# EAGLE design Arduino-DUE-SHEILD-4X4-Blank-Pin-Schematic (EAGLE 8.2.1)
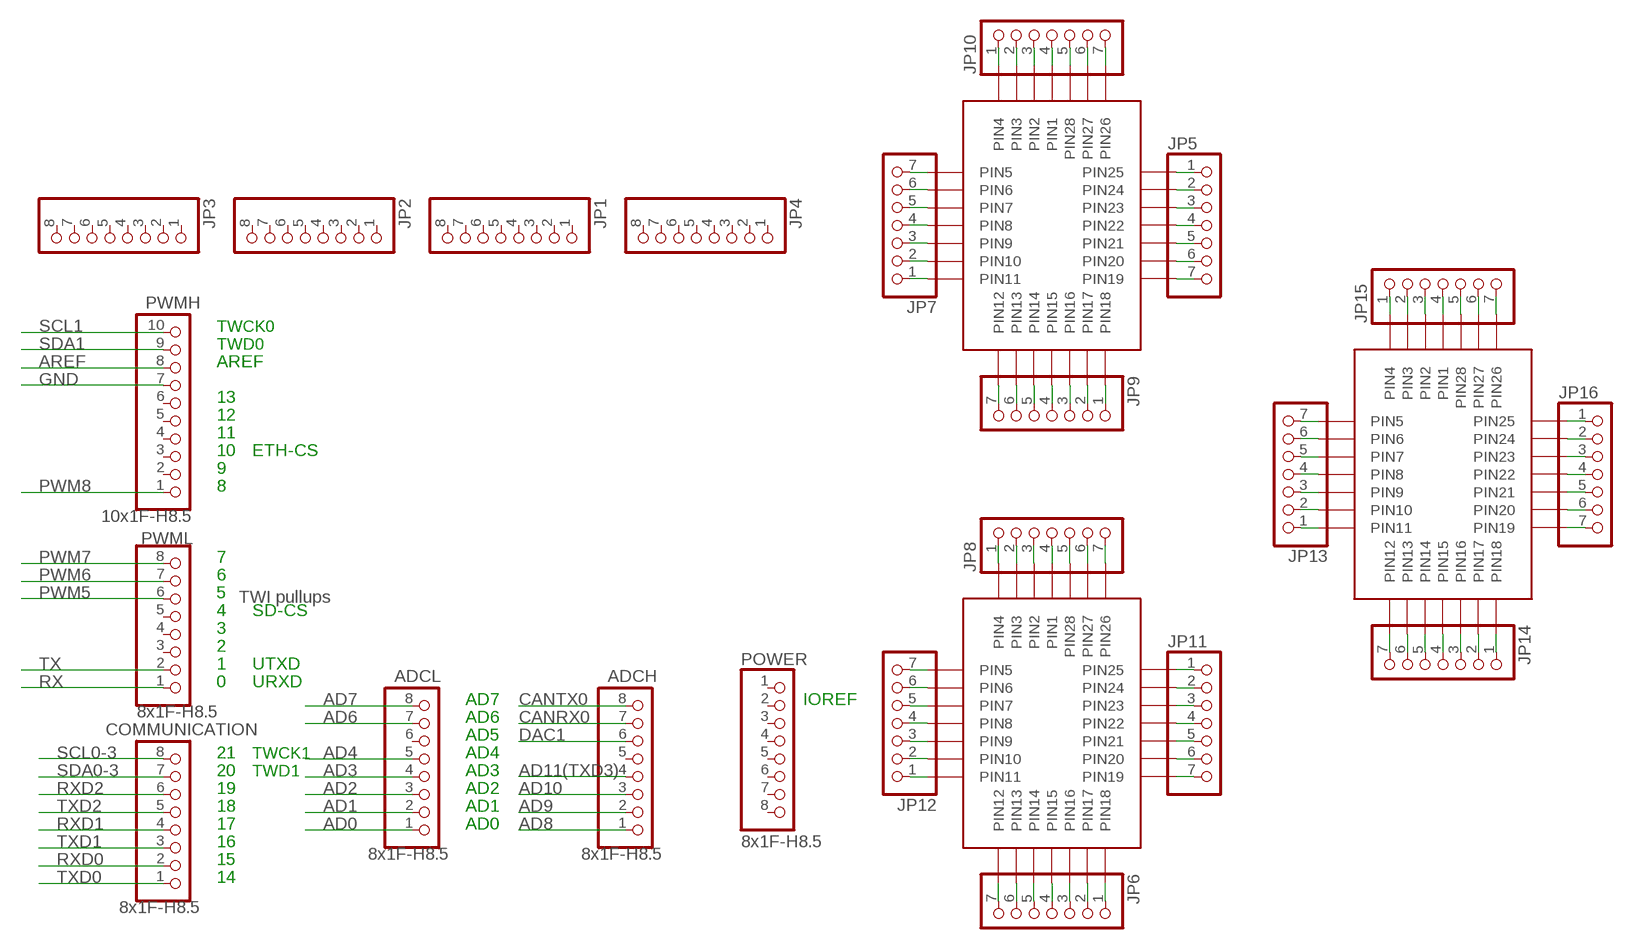
[diagram p0: schematic, sheet 1]

## Parts
ADCH  8x1F-H8.5  PINHD-1X8  [1X08]
ADCL  8x1F-H8.5  PINHD-1X8  [1X08]
COMMUNICATION  8x1F-H8.5  PINHD-1X8  [1X08]
JP1  PINHD-1X8  [1X08]
JP2  PINHD-1X8  [1X08]
JP3  PINHD-1X8  [1X08]
JP4  PINHD-1X8  [1X08]
JP5  PINHD-1X7  [1X07]
JP6  PINHD-1X7  [1X07]
JP7  PINHD-1X7  [1X07]
JP8  PINHD-1X7  [1X07]
JP9  PINHD-1X7  [1X07]
JP10  PINHD-1X7  [1X07]
JP11  PINHD-1X7  [1X07]
JP12  PINHD-1X7  [1X07]
JP13  PINHD-1X7  [1X07]
JP14  PINHD-1X7  [1X07]
JP15  PINHD-1X7  [1X07]
JP16  PINHD-1X7  [1X07]
POWER  8x1F-H8.5  PINHD-1X8  [1X08]
PWMH  10x1F-H8.5  PINHD-1X10  [1X10]
PWML  8x1F-H8.5  PINHD-1X8  [1X08]
U$1  S28  [S28]
U$2  S28  [S28]
U$3  S28  [S28]

## Nets
AD0: ADCL.1
AD1: ADCL.2
AD2: ADCL.3
AD3: ADCL.4
AD4: ADCL.5
AD6: ADCL.7
AD7: ADCL.8
AD8: ADCH.1
AD9: ADCH.2
AD10: ADCH.3
AD11(TXD3): ADCH.4
AREF: PWMH.8
CANRX0: ADCH.7
CANTX0: ADCH.8
DAC1: ADCH.6
GND: PWMH.7
N$3: JP7.7 U$1.5(PIN5)
N$11: JP7.6 U$1.6(PIN6)
N$12: JP7.5 U$1.7(PIN7)
N$13: JP7.4 U$1.8(PIN8)
N$14: JP7.3 U$1.9(PIN9)
N$15: JP7.2 U$1.10(PIN10)
N$16: JP7.1 U$1.11(PIN11)
N$17: JP9.7 U$1.12(PIN12)
N$18: JP9.6 U$1.13(PIN13)
N$19: JP9.5 U$1.14(PIN14)
N$20: JP9.4 U$1.15(PIN15)
N$21: JP9.3 U$1.16(PIN16)
N$22: JP9.2 U$1.17(PIN17)
N$23: JP9.1 U$1.18(PIN18)
N$24: JP5.7 U$1.19(PIN19)
N$25: JP5.6 U$1.20(PIN20)
N$26: JP5.5 U$1.21(PIN21)
N$27: JP5.4 U$1.22(PIN22)
N$28: JP5.3 U$1.23(PIN23)
N$29: JP5.2 U$1.24(PIN24)
N$30: JP5.1 U$1.25(PIN25)
N$31: JP10.1 U$1.4(PIN4)
N$32: JP10.2 U$1.3(PIN3)
N$33: JP10.3 U$1.2(PIN2)
N$34: JP10.4 U$1.1(PIN1)
N$35: JP10.5 U$1.28(PIN28)
N$36: JP10.6 U$1.27(PIN27)
N$37: JP10.7 U$1.26(PIN26)
N$38: JP8.1 U$2.4(PIN4)
N$39: JP8.2 U$2.3(PIN3)
N$40: JP8.3 U$2.2(PIN2)
N$41: JP8.4 U$2.1(PIN1)
N$42: JP8.5 U$2.28(PIN28)
N$43: JP8.6 U$2.27(PIN27)
N$44: JP8.7 U$2.26(PIN26)
N$45: JP13.7 U$3.5(PIN5)
N$46: JP13.6 U$3.6(PIN6)
N$47: JP13.5 U$3.7(PIN7)
N$48: JP13.4 U$3.8(PIN8)
N$49: JP13.3 U$3.9(PIN9)
N$50: JP13.2 U$3.10(PIN10)
N$51: JP13.1 U$3.11(PIN11)
N$52: JP6.7 U$2.12(PIN12)
N$53: JP6.6 U$2.13(PIN13)
N$54: JP6.5 U$2.14(PIN14)
N$55: JP6.4 U$2.15(PIN15)
N$56: JP6.3 U$2.16(PIN16)
N$57: JP6.2 U$2.17(PIN17)
N$58: JP6.1 U$2.18(PIN18)
N$59: JP11.7 U$2.19(PIN19)
N$60: JP11.6 U$2.20(PIN20)
N$61: JP11.5 U$2.21(PIN21)
N$62: JP11.4 U$2.22(PIN22)
N$63: JP11.3 U$2.23(PIN23)
N$64: JP11.2 U$2.24(PIN24)
N$65: JP11.1 U$2.25(PIN25)
N$66: JP12.7 U$2.5(PIN5)
N$67: JP12.6 U$2.6(PIN6)
N$68: JP12.5 U$2.7(PIN7)
N$69: JP12.4 U$2.8(PIN8)
N$70: JP12.3 U$2.9(PIN9)
N$71: JP12.2 U$2.10(PIN10)
N$72: JP12.1 U$2.11(PIN11)
N$73: JP15.1 U$3.4(PIN4)
N$74: JP15.2 U$3.3(PIN3)
N$75: JP15.3 U$3.2(PIN2)
N$76: JP15.4 U$3.1(PIN1)
N$77: JP15.5 U$3.28(PIN28)
N$78: JP15.6 U$3.27(PIN27)
N$79: JP15.7 U$3.26(PIN26)
N$80: JP16.1 U$3.25(PIN25)
N$81: JP16.2 U$3.24(PIN24)
N$82: JP16.3 U$3.23(PIN23)
N$83: JP16.4 U$3.22(PIN22)
N$84: JP16.5 U$3.21(PIN21)
N$85: JP16.6 U$3.20(PIN20)
N$86: JP16.7 U$3.19(PIN19)
N$87: JP14.1 U$3.18(PIN18)
N$88: JP14.2 U$3.17(PIN17)
N$89: JP14.3 U$3.16(PIN16)
N$90: JP14.4 U$3.15(PIN15)
N$91: JP14.5 U$3.14(PIN14)
N$92: JP14.6 U$3.13(PIN13)
N$93: JP14.7 U$3.12(PIN12)
PWM5: PWML.6
PWM6: PWML.7
PWM7: PWML.8
PWM8: PWMH.1
RX: PWML.1
RXD0: COMMUNICATION.2
RXD1: COMMUNICATION.4
RXD2: COMMUNICATION.6
SCL0-3: COMMUNICATION.8
SCL1: PWMH.10
SDA0-3: COMMUNICATION.7
SDA1: PWMH.9
TX: PWML.2
TXD0: COMMUNICATION.1
TXD1: COMMUNICATION.3
TXD2: COMMUNICATION.5
Unconnected: ADCH.5 ADCL.6 JP1.1 JP1.2 JP1.3 JP1.4 JP1.5 JP1.6 JP1.7 JP1.8 JP2.1 JP2.2 JP2.3 JP2.4 JP2.5 JP2.6 JP2.7 JP2.8 JP3.1 JP3.2 JP3.3 JP3.4 JP3.5 JP3.6 JP3.7 JP3.8 JP4.1 JP4.2 JP4.3 JP4.4 JP4.5 JP4.6 JP4.7 JP4.8 POWER.1 POWER.2 POWER.3 POWER.4 POWER.5 POWER.6 POWER.7 POWER.8 PWMH.2 PWMH.3 PWMH.4 PWMH.5 PWMH.6 PWML.3 PWML.4 PWML.5

## Notes on the sheet
- TWCK0
- TWD0
- AREF
- 13
- 12
- 11
- 10 | ETH-CS
- 9
- 8
- 7
- 6
- 5 | TWI pullups
- 4 | SD-CS
- 3
- 2
- 1 | UTXD
- 0 | URXD
- AD7 | IOREF
- AD6
- AD5
- 21 | TWCK1 | AD4
- 20 | TWD1 | AD3
- 19 | AD2
- 18 | AD1
- 17 | AD0
- 16
- 15
- 14

## Library data of the parts
ADCH ADCL COMMUNICATION POWER PWML = SmartPrj:PINHD-1X8: PIN HEADER
JP1-JP4 = pinhead:PINHD-1X8: PIN HEADER
JP5-JP16 = pinhead:PINHD-1X7: PIN HEADER
PWMH = SmartPrj:PINHD-1X10: PIN HEADER
U$1-U$3 = plcc-socket:S28

## Net classes
0 default: width 0.203 mm, drill 0.406 mm, clearance 0.203 mm
1 USB: width 0.203 mm, drill 0.406 mm, clearance 0.203 mm
2 gnd: width 0.203 mm, drill 0.406 mm, clearance 0.203 mm
3 usbvcc: width 0.203 mm, drill 0.406 mm, clearance 0.203 mm
4 USBpair: width 0.254 mm, drill 0.406 mm, clearance 0.61 mm

## Board
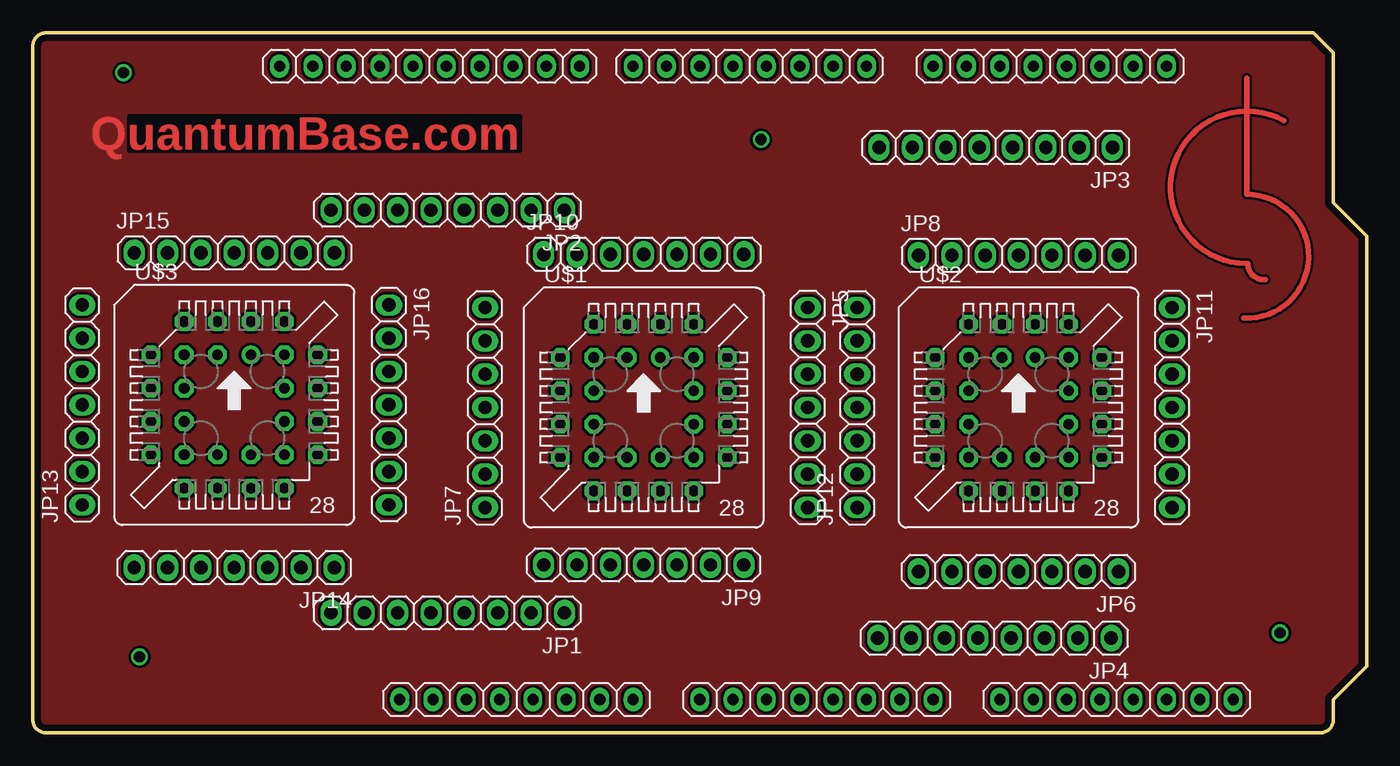
[diagram p1: board, top side]
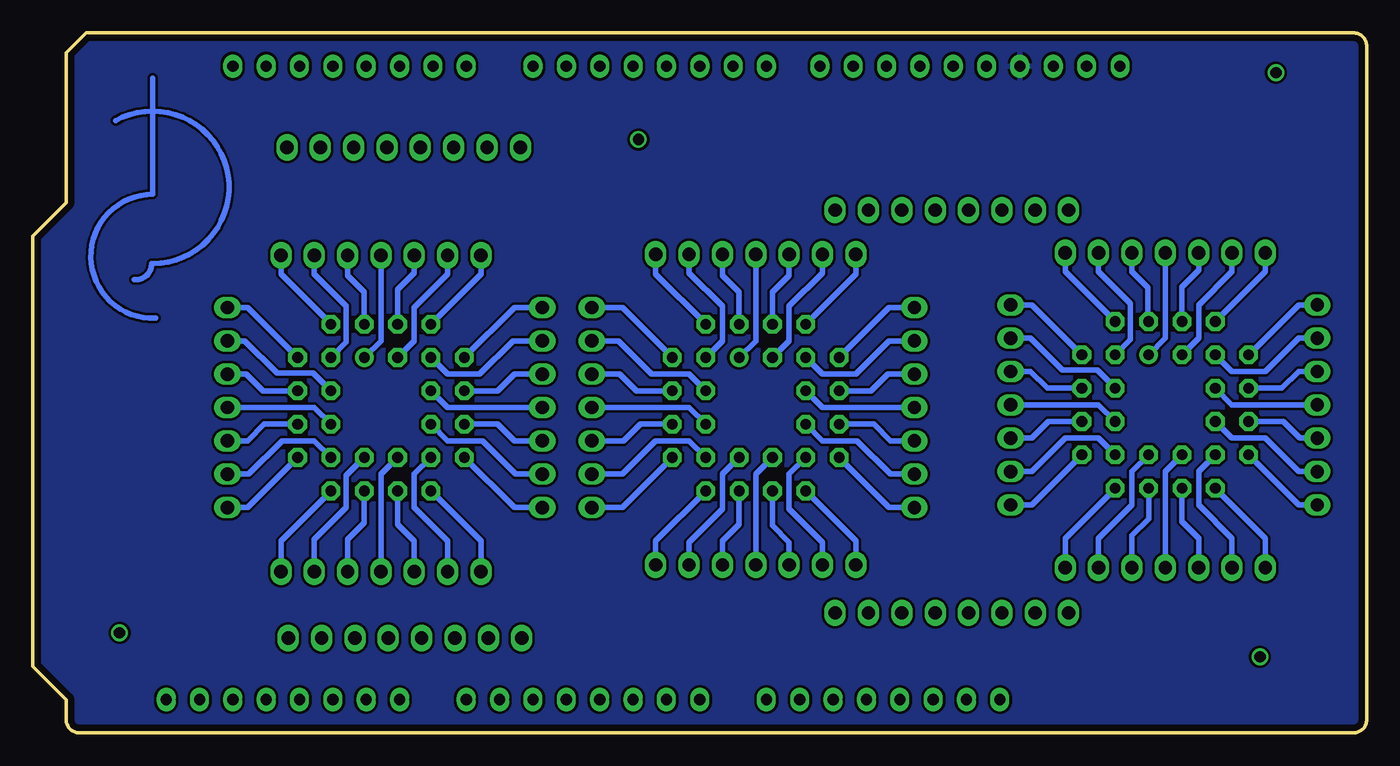
[diagram p2: board, bottom side, seen from below]

Size 101.6 x 53.34 mm. Coordinates in mm from the lower left corner, seen from the top.
Outline: 97.54,53.34 99.06,51.82 99.06,40.39 101.6,37.85 101.6,5.08 99.06,2.54 99.06,1 arc-90 98.06,0 1,0 arc-90 0,1 0,52.34 arc-90 1,53.34 97.54,53.34
Copper layers (1*16): Top 0.035mm / dielectric 1.6mm / Bottom 0.035mm
Design rules "default *": minimum track width 8mil, minimum drill 16mil, track to track 0.205mm, track to pad 0.25mm, pad to pad 0.25mm, via to via 0.205mm, smd to smd 0.205mm, copper to edge 20mil, drill to drill 12mil, minimum pad ring 12mil, minimum via ring 8mil, stop-mask expansion 2mil, vias tented up to drill 25mil, thermal gap 8mil

### Footprints (pad centres in the part's own frame; a part is rotated, then mirrored left to right if it is on the bottom)
1X08 = drill 0.85 pad 1.422 long: 1 -8.89,0; 2 -6.35,0; 3 -3.81,0; 4 -1.27,0; 5 1.27,0; 6 3.81,0; 7 6.35,0; 8 8.89,0
1X08' = drill 1.016 long: 1 -8.89,0; 2 -6.35,0; 3 -3.81,0; 4 -1.27,0; 5 1.27,0; 6 3.81,0; 7 6.35,0; 8 8.89,0
1X07 = drill 1.016 long: 1 -7.62,0; 2 -5.08,0; 3 -2.54,0; 4 0,0; 5 2.54,0; 6 5.08,0; 7 7.62,0
1X10 = drill 0.85 pad 1.422 long: 1 -11.43,0; 2 -8.89,0; 3 -6.35,0; 4 -3.81,0; 5 -1.27,0; 6 1.27,0; 7 3.81,0; 8 6.35,0; 9 8.89,0; 10 11.43,0
S28 = drill 0.813: 1 1.27,3.81 | drill 0.813 octagon: 2 -1.27,6.35; 3 -1.27,3.81; 4 -3.81,6.35; 5 -6.35,3.81; 6 -3.81,3.81; 7 -6.35,1.27; 8 -3.81,1.27; 9 -6.35,-1.27; 10 -3.81,-1.27; 11 -6.35,-3.81; 12 -3.81,-6.35; 13 -3.81,-3.81; 14 -1.27,-6.35; 15 -1.27,-3.81; 16 1.27,-6.35; 17 1.27,-3.81; 18 3.81,-6.35; 19 6.35,-3.81; 20 3.81,-3.81; 21 6.35,-1.27; 22 3.81,-1.27; 23 6.35,1.27; 24 3.81,1.27; 25 6.35,3.81; 26 3.81,6.35; 27 3.81,3.81; 28 1.27,6.35

### Placement (x,y rotation side)
ADCH  82.55,2.54 0 top
ADCL  59.69,2.54 0 top
COMMUNICATION  77.47,50.8 0 top
JP1  [1X08']  31.6,9.14 180 top
JP2  [1X08']  31.6,39.83 180 top
JP3  [1X08']  73.36,44.6 180 top
JP4  [1X08']  73.25,7.21 180 top
JP5  59.03,24.79 270 top
JP6  75.08,12.29 180 top
JP7  34.44,24.79 90 top
JP8  75.08,36.37 0 top
JP9  46.53,12.8 180 top
JP10  46.53,36.47 0 top
JP11  86.77,24.79 270 top
JP12  62.79,24.79 90 top
JP13  3.76,24.99 90 top
JP14  15.34,12.6 180 top
JP15  15.34,36.58 0 top
JP16  27.13,24.99 270 top
POWER  36.83,2.54 0 top
PWMH  30.23,50.8 180 top
PWML  54.61,50.8 180 top
U$1  46.53,24.79 0 top
U$2  75.08,24.79 0 top
U$3  15.34,24.99 0 top

### Tracks (layer width: path | path; a pad name or v marks a point on that pad's centre or on a via)
GND
  pour Top: -1.42,54.46 103.73,54.46 103.73,-2.95 -1.42,-2.95
  pour Bottom: -2.13,54.36 104.04,54.36 104.04,-2.54 -2.13,-2.54
N$1
  Top 0.406: 92.46,49.89 92.46,41.05 arc-182 92.25,31.6
N$2
  Bottom 0.406: 92.46,35.76 arc-209 95.3,46.63
N$3
  Bottom 0.406: U$1.5 36.37,32.41 JP7.7
N$4
  Bottom 0.406: 93.88,34.54 arc-97 92.56,35.76
N$8
  Bottom 0.406: 92.46,49.89 92.46,41.05 arc-182 92.25,31.6
N$9
  Top 0.406: 92.46,35.76 arc-209 95.3,46.63
N$10
  Top 0.406: 93.88,34.54 arc-97 92.56,35.76
N$11
  Bottom 0.406: U$1.6 41.45,27.33 38.91,27.33 36.37,29.87 JP7.6
N$12
  Bottom 0.406: U$1.7 37.74,26.06 36.47,27.33 JP7.5
N$13
  Bottom 0.406: U$1.8 41.45,24.79 JP7.4
N$14
  Bottom 0.406: U$1.9 37.54,23.52 36.27,22.25 JP7.3
N$15
  Bottom 0.406: U$1.10 41.45,22.25 38.81,22.25 36.27,19.71 JP7.2
N$16
  Bottom 0.406: U$1.11 36.37,17.17 JP7.1
N$17
  Bottom 0.406: U$1.12 38.91,14.63 JP9.7
N$18
  Bottom 0.406: U$1.13 43.99,19.71 43.99,17.07 41.45,14.53 JP9.6
N$19
  Bottom 0.406: U$1.14 45.26,15.8 43.99,14.53 JP9.5
N$20
  Bottom 0.406: U$1.15 46.53,19.71 JP9.4
N$21
  Bottom 0.406: U$1.16 47.8,15.9 49.07,14.63 JP9.3
N$22
  Bottom 0.406: U$1.17 49.07,19.71 49.07,17.07 51.61,14.53 JP9.2
N$23
  Bottom 0.406: U$1.18 54.15,14.63 JP9.1
N$24
  Bottom 0.406: U$1.19 56.69,17.17 JP5.7
N$25
  Bottom 0.406: U$1.20 51.61,22.25 54.15,22.25 56.69,19.71 JP5.6
N$26
  Bottom 0.406: U$1.21 55.32,23.52 56.59,22.25 JP5.5
N$27
  Bottom 0.406: U$1.22 51.61,24.79 JP5.4
N$28
  Bottom 0.406: U$1.23 55.63,26.06 56.9,27.33 JP5.3
N$29
  Bottom 0.406: U$1.24 51.61,27.33 54.46,27.33 57,29.87 JP5.2
N$30
  Bottom 0.406: U$1.25 56.69,32.41 JP5.1
N$31
  Bottom 0.406: U$1.4 38.91,34.95 JP10.1
N$32
  Bottom 0.406: JP10.2 41.45,35.05 43.99,32.51 43.99,29.87 U$1.3
N$33
  Bottom 0.406: U$1.2 45.26,33.58 43.99,34.85 JP10.3
N$34
  Bottom 0.406: U$1.1 46.53,29.87 JP10.4
N$35
  Bottom 0.406: U$1.28 47.8,33.58 49.07,34.85 JP10.5
N$36
  Bottom 0.406: JP10.6 51.61,35.05 49.07,32.51 49.07,29.87 U$1.27
N$37
  Bottom 0.406: U$1.26 54.15,34.95 JP10.7
N$38
  Bottom 0.406: U$2.4 67.46,34.95 JP8.1
N$39
  Bottom 0.406: JP8.2 70,34.95 72.54,32.41 72.54,29.87 U$2.3
N$40
  Bottom 0.406: U$2.2 73.81,33.78 72.54,35.05 JP8.3
N$41
  Bottom 0.406: U$2.1 75.08,29.87 JP8.4
N$42
  Bottom 0.406: U$2.28 76.35,33.58 77.62,34.85 JP8.5
N$43
  Bottom 0.406: U$2.27 77.72,29.77 77.72,32.51 80.16,34.95 JP8.6
N$44
  Bottom 0.406: U$2.26 82.7,34.95 JP8.7
N$45
  Bottom 0.406: U$3.5 5.18,32.61 JP13.7
N$46
  Bottom 0.406: U$3.6 10.26,27.53 7.72,27.53 5.18,30.07 JP13.6
N$47
  Bottom 0.406: U$3.7 6.45,26.26 5.18,27.53 JP13.5
N$48
  Bottom 0.406: U$3.8 10.26,24.99 JP13.4
N$49
  Bottom 0.406: U$3.9 6.35,23.72 5.08,22.45 JP13.3
N$50
  Bottom 0.406: U$3.10 10.26,22.45 7.72,22.45 5.18,19.91 JP13.2
N$51
  Bottom 0.406: U$3.11 5.18,17.37 JP13.1
N$52
  Bottom 0.406: U$2.12 67.46,14.63 JP6.7
N$53
  Bottom 0.406: U$2.13 72.54,19.71 72.54,17.17 70,14.63 JP6.6
N$54
  Bottom 0.406: U$2.14 73.81,15.9 72.54,14.63 JP6.5
N$55
  Bottom 0.406: U$2.15 75.08,19.71 JP6.4
N$56
  Bottom 0.406: U$2.16 76.35,16 77.62,14.73 JP6.3
N$57
  Bottom 0.406: U$2.17 77.72,19.61 77.72,17.17 80.16,14.73 JP6.2
N$58
  Bottom 0.406: U$2.18 82.7,14.63 JP6.1
N$59
  Bottom 0.406: U$2.19 85.24,17.17 JP11.7
N$60
  Bottom 0.406: U$2.20 80.16,22.25 82.6,22.25 85.14,19.71 JP11.6
N$61
  Bottom 0.406: U$2.21 83.97,23.52 85.24,22.25 JP11.5
N$62
  Bottom 0.406: U$2.22 80.16,24.79 JP11.4
N$63
  Bottom 0.406: U$2.23 84.07,26.06 85.34,27.33 JP11.3
N$64
  Bottom 0.406: U$2.24 80.26,27.43 83.01,27.43 85.45,29.87 JP11.2
N$65
  Bottom 0.406: U$2.25 85.24,32.41 JP11.1
N$66
  Bottom 0.406: U$2.5 64.92,32.41 JP12.7
N$67
  Bottom 0.406: U$2.6 70,27.33 67.56,27.33 65.02,29.87 JP12.6
N$68
  Bottom 0.406: U$2.7 66.19,26.06 64.92,27.33 JP12.5
N$69
  Bottom 0.406: U$2.8 70,24.79 JP12.4
N$70
  Bottom 0.406: U$2.9 66.19,23.52 64.92,22.25 JP12.3
N$71
  Bottom 0.406: U$2.10 70,22.25 67.36,22.25 64.82,19.71 JP12.2
N$72
  Bottom 0.406: U$2.11 64.92,17.17 JP12.1
N$73
  Bottom 0.406: U$3.4 7.72,35.15 JP15.1
N$74
  Bottom 0.406: U$3.3 12.8,30.07 12.8,32.61 10.26,35.15 JP15.2
N$75
  Bottom 0.406: U$3.2 14.07,33.98 12.8,35.26 JP15.3
N$76
  Bottom 0.406: U$3.1 15.34,30.07 JP15.4
N$77
  Bottom 0.406: U$3.28 16.66,31.39 16.66,33.93 17.88,35.15 JP15.5
N$78
  Bottom 0.406: U$3.27 17.98,29.97 17.98,32.72 20.42,35.15 JP15.6
N$79
  Bottom 0.406: U$3.26 22.96,35.15 JP15.7
N$80
  Bottom 0.406: U$3.25 25.5,32.61 JP16.1
N$81
  Bottom 0.406: U$3.24 20.52,27.64 23.16,27.64 25.6,30.07 JP16.2
N$82
  Bottom 0.406: U$3.23 24.33,26.26 25.6,27.53 JP16.3
N$83
  Bottom 0.406: U$3.22 20.42,24.99 JP16.4
N$84
  Bottom 0.406: U$3.21 24.23,23.72 25.5,22.45 JP16.5
N$85
  Bottom 0.406: U$3.20 20.42,22.45 22.96,22.45 25.5,19.91 JP16.6
N$86
  Bottom 0.406: U$3.19 25.5,17.37 JP16.7
N$87
  Bottom 0.406: U$3.18 22.96,14.83 JP14.1
N$88
  Bottom 0.406: U$3.17 17.88,19.91 17.88,17.37 20.42,14.83 JP14.2
N$89
  Bottom 0.406: U$3.16 16.61,16.31 17.88,15.04 JP14.3
N$90
  Bottom 0.406: U$3.15 15.34,19.91 JP14.4
N$91
  Bottom 0.406: U$3.14 14.07,16.1 12.8,14.83 JP14.5
N$92
  Bottom 0.406: U$3.13 12.8,19.91 12.8,17.37 10.26,14.83 JP14.6
N$93
  Bottom 0.406: U$3.12 7.72,14.83 JP14.7
N$94  (via drill 0.85)
  other vias: 6.91,50.29
N$95  (via drill 0.85)
  other vias: 8.13,5.79
N$96  (via drill 0.85)
  other vias: 95,7.62
N$97  (via drill 0.85)
  other vias: 55.47,45.21

### Text on the board
Top: QuantumBase.com